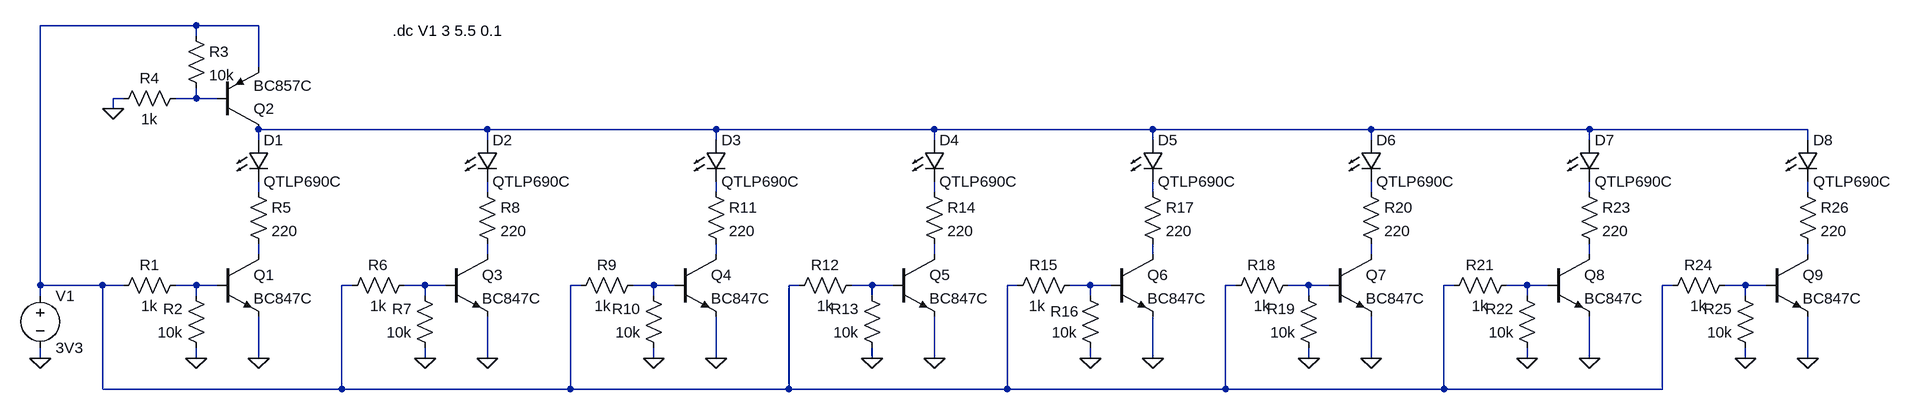
[diagram p0: schematic Comutarea7Segmentului.asc]
Comutarea7Segmentului.asc, the LTspice schematic file:
Version 4
SHEET 1 2660 680
WIRE 48 -272 -192 -272
WIRE 144 -272 48 -272
WIRE 48 -256 48 -272
WIRE 144 -208 144 -272
WIRE -64 -160 -80 -160
WIRE 48 -160 48 -176
WIRE 48 -160 16 -160
WIRE 80 -160 48 -160
WIRE -80 -144 -80 -160
WIRE 496 -112 144 -112
WIRE 848 -112 496 -112
WIRE 1184 -112 848 -112
WIRE 1520 -112 1184 -112
WIRE 1856 -112 1520 -112
WIRE 2192 -112 1856 -112
WIRE 2528 -112 2192 -112
WIRE 144 -96 144 -112
WIRE 496 -96 496 -112
WIRE 848 -96 848 -112
WIRE 1184 -96 1184 -112
WIRE 1520 -96 1520 -112
WIRE 1856 -96 1856 -112
WIRE 2192 -96 2192 -112
WIRE 2528 -96 2528 -112
WIRE 144 -16 144 -32
WIRE 496 -16 496 -32
WIRE 848 -16 848 -32
WIRE 1184 -16 1184 -32
WIRE 1520 -16 1520 -32
WIRE 1856 -16 1856 -32
WIRE 2192 -16 2192 -32
WIRE 2528 -16 2528 -32
WIRE 144 80 144 64
WIRE 496 80 496 64
WIRE 848 80 848 64
WIRE 1184 80 1184 64
WIRE 1520 80 1520 64
WIRE 1856 80 1856 64
WIRE 2192 80 2192 64
WIRE 2528 80 2528 64
WIRE -192 128 -192 -272
WIRE -96 128 -192 128
WIRE -64 128 -96 128
WIRE 48 128 16 128
WIRE 80 128 48 128
WIRE 288 128 272 128
WIRE 400 128 368 128
WIRE 432 128 400 128
WIRE 640 128 624 128
WIRE 752 128 720 128
WIRE 784 128 752 128
WIRE 976 128 960 128
WIRE 1088 128 1056 128
WIRE 1120 128 1088 128
WIRE 1312 128 1296 128
WIRE 1424 128 1392 128
WIRE 1456 128 1424 128
WIRE 1648 128 1632 128
WIRE 1760 128 1728 128
WIRE 1792 128 1760 128
WIRE 1984 128 1968 128
WIRE 2096 128 2064 128
WIRE 2128 128 2096 128
WIRE 2320 128 2304 128
WIRE 2432 128 2400 128
WIRE 2464 128 2432 128
WIRE -192 144 -192 128
WIRE 48 144 48 128
WIRE 400 144 400 128
WIRE 752 144 752 128
WIRE 1088 144 1088 128
WIRE 1424 144 1424 128
WIRE 1760 144 1760 128
WIRE 2096 144 2096 128
WIRE 2432 144 2432 128
WIRE -192 240 -192 224
WIRE 48 240 48 224
WIRE 144 240 144 176
WIRE 400 240 400 224
WIRE 496 240 496 176
WIRE 752 240 752 224
WIRE 848 240 848 176
WIRE 1088 240 1088 224
WIRE 1184 240 1184 176
WIRE 1424 240 1424 224
WIRE 1520 240 1520 176
WIRE 1760 240 1760 224
WIRE 1856 240 1856 176
WIRE 2096 240 2096 224
WIRE 2192 240 2192 176
WIRE 2432 240 2432 224
WIRE 2528 240 2528 176
WIRE -96 288 -96 128
WIRE 272 288 272 128
WIRE 272 288 -96 288
WIRE 624 288 624 128
WIRE 624 288 272 288
WIRE 960 288 960 128
WIRE 960 288 624 288
WIRE 1296 288 1296 128
WIRE 1296 288 960 288
WIRE 1632 288 1632 128
WIRE 1632 288 1296 288
WIRE 1968 288 1968 128
WIRE 1968 288 1632 288
WIRE 2304 288 2304 128
WIRE 2304 288 1968 288
FLAG 48 240 0
FLAG -192 240 0
FLAG 144 240 0
FLAG -80 -144 0
FLAG 400 240 0
FLAG 496 240 0
FLAG 752 240 0
FLAG 848 240 0
FLAG 1088 240 0
FLAG 1184 240 0
FLAG 1424 240 0
FLAG 1520 240 0
FLAG 1760 240 0
FLAG 1856 240 0
FLAG 2096 240 0
FLAG 2192 240 0
FLAG 2432 240 0
FLAG 2528 240 0
SYMBOL npn 80 80 R0
SYMATTR InstName Q1
SYMATTR Value BC847C
SYMBOL res 32 112 R90
WINDOW 0 0 56 VBottom 2
WINDOW 3 32 56 VTop 2
SYMATTR InstName R1
SYMATTR Value 1k
SYMBOL res 64 240 R180
WINDOW 0 36 76 Left 2
WINDOW 3 36 40 Left 2
SYMATTR InstName R2
SYMATTR Value 10k
SYMBOL voltage -192 128 R0
SYMATTR InstName V1
SYMATTR Value 3V3
SYMBOL pnp 80 -112 M180
SYMATTR InstName Q2
SYMATTR Value BC857C
SYMBOL res 32 -272 R0
SYMATTR InstName R3
SYMATTR Value 10k
SYMBOL res 32 -176 R90
WINDOW 0 0 56 VBottom 2
WINDOW 3 32 56 VTop 2
SYMATTR InstName R4
SYMATTR Value 1k
SYMBOL res 128 -32 R0
SYMATTR InstName R5
SYMATTR Value 220
SYMBOL LED 128 -96 R0
SYMATTR InstName D1
SYMATTR Value QTLP690C
SYMATTR Description Diode
SYMATTR Type diode
SYMBOL npn 432 80 R0
SYMATTR InstName Q3
SYMATTR Value BC847C
SYMBOL res 384 112 R90
WINDOW 0 0 56 VBottom 2
WINDOW 3 32 56 VTop 2
SYMATTR InstName R6
SYMATTR Value 1k
SYMBOL res 416 240 R180
WINDOW 0 36 76 Left 2
WINDOW 3 36 40 Left 2
SYMATTR InstName R7
SYMATTR Value 10k
SYMBOL res 480 -32 R0
SYMATTR InstName R8
SYMATTR Value 220
SYMBOL LED 480 -96 R0
SYMATTR InstName D2
SYMATTR Value QTLP690C
SYMATTR Description Diode
SYMATTR Type diode
SYMBOL npn 784 80 R0
SYMATTR InstName Q4
SYMATTR Value BC847C
SYMBOL res 736 112 R90
WINDOW 0 0 56 VBottom 2
WINDOW 3 32 62 VTop 2
SYMATTR InstName R9
SYMATTR Value 1k
SYMBOL res 768 240 R180
WINDOW 0 36 76 Left 2
WINDOW 3 36 40 Left 2
SYMATTR InstName R10
SYMATTR Value 10k
SYMBOL res 832 -32 R0
SYMATTR InstName R11
SYMATTR Value 220
SYMBOL LED 832 -96 R0
SYMATTR InstName D3
SYMATTR Value QTLP690C
SYMATTR Description Diode
SYMATTR Type diode
SYMBOL npn 1120 80 R0
SYMATTR InstName Q5
SYMATTR Value BC847C
SYMBOL res 1072 112 R90
WINDOW 0 0 56 VBottom 2
WINDOW 3 32 56 VTop 2
SYMATTR InstName R12
SYMATTR Value 1k
SYMBOL res 1104 240 R180
WINDOW 0 36 76 Left 2
WINDOW 3 36 40 Left 2
SYMATTR InstName R13
SYMATTR Value 10k
SYMBOL res 1168 -32 R0
SYMATTR InstName R14
SYMATTR Value 220
SYMBOL LED 1168 -96 R0
SYMATTR InstName D4
SYMATTR Value QTLP690C
SYMATTR Description Diode
SYMATTR Type diode
SYMBOL npn 1456 80 R0
SYMATTR InstName Q6
SYMATTR Value BC847C
SYMBOL res 1408 112 R90
WINDOW 0 0 56 VBottom 2
WINDOW 3 32 66 VTop 2
SYMATTR InstName R15
SYMATTR Value 1k
SYMBOL res 1440 240 R180
WINDOW 0 33 72 Left 2
WINDOW 3 36 40 Left 2
SYMATTR InstName R16
SYMATTR Value 10k
SYMBOL res 1504 -32 R0
SYMATTR InstName R17
SYMATTR Value 220
SYMBOL LED 1504 -96 R0
SYMATTR InstName D5
SYMATTR Value QTLP690C
SYMATTR Description Diode
SYMATTR Type diode
SYMBOL npn 1792 80 R0
SYMATTR InstName Q7
SYMATTR Value BC847C
SYMBOL res 1744 112 R90
WINDOW 0 0 56 VBottom 2
WINDOW 3 32 56 VTop 2
SYMATTR InstName R18
SYMATTR Value 1k
SYMBOL res 1776 240 R180
WINDOW 0 36 76 Left 2
WINDOW 3 36 40 Left 2
SYMATTR InstName R19
SYMATTR Value 10k
SYMBOL res 1840 -32 R0
SYMATTR InstName R20
SYMATTR Value 220
SYMBOL LED 1840 -96 R0
SYMATTR InstName D6
SYMATTR Value QTLP690C
SYMATTR Description Diode
SYMATTR Type diode
SYMBOL npn 2128 80 R0
SYMATTR InstName Q8
SYMATTR Value BC847C
SYMBOL res 2080 112 R90
WINDOW 0 0 56 VBottom 2
WINDOW 3 32 56 VTop 2
SYMATTR InstName R21
SYMATTR Value 1k
SYMBOL res 2112 240 R180
WINDOW 0 36 76 Left 2
WINDOW 3 36 40 Left 2
SYMATTR InstName R22
SYMATTR Value 10k
SYMBOL res 2176 -32 R0
SYMATTR InstName R23
SYMATTR Value 220
SYMBOL LED 2176 -96 R0
SYMATTR InstName D7
SYMATTR Value QTLP690C
SYMATTR Description Diode
SYMATTR Type diode
SYMBOL npn 2464 80 R0
SYMATTR InstName Q9
SYMATTR Value BC847C
SYMBOL res 2416 112 R90
WINDOW 0 0 56 VBottom 2
WINDOW 3 32 56 VTop 2
SYMATTR InstName R24
SYMATTR Value 1k
SYMBOL res 2448 240 R180
WINDOW 0 36 76 Left 2
WINDOW 3 36 40 Left 2
SYMATTR InstName R25
SYMATTR Value 10k
SYMBOL res 2512 -32 R0
SYMATTR InstName R26
SYMATTR Value 220
SYMBOL LED 2512 -96 R0
SYMATTR InstName D8
SYMATTR Value QTLP690C
SYMATTR Description Diode
SYMATTR Type diode
TEXT 350 -264 Left 2 !.dc V1 3 5.5 0.1

The netlist it stands for:
* Comutarea7Segmentului.asc
Q1 N012 N020 0 0 BC847C
R1 N020 N001 1k
R2 0 N020 10k
V1 N001 0 3V3
Q2 N003 N002 N001 0 BC857C
R3 N001 N002 10k
R4 N002 0 1k
R5 N004 N012 220
D1 N003 N004 QTLP690C
Q3 N013 N021 0 0 BC847C
R6 N021 N001 1k
R7 0 N021 10k
R8 N005 N013 220
D2 N003 N005 QTLP690C
Q4 N014 N022 0 0 BC847C
R9 N022 N001 1k
R10 0 N022 10k
R11 N006 N014 220
D3 N003 N006 QTLP690C
Q5 N015 N023 0 0 BC847C
R12 N023 N001 1k
R13 0 N023 10k
R14 N007 N015 220
D4 N003 N007 QTLP690C
Q6 N016 N024 0 0 BC847C
R15 N024 N001 1k
R16 0 N024 10k
R17 N008 N016 220
D5 N003 N008 QTLP690C
Q7 N017 N025 0 0 BC847C
R18 N025 N001 1k
R19 0 N025 10k
R20 N009 N017 220
D6 N003 N009 QTLP690C
Q8 N018 N026 0 0 BC847C
R21 N026 N001 1k
R22 0 N026 10k
R23 N010 N018 220
D7 N003 N010 QTLP690C
Q9 N019 N027 0 0 BC847C
R24 N027 N001 1k
R25 0 N027 10k
R26 N011 N019 220
D8 N003 N011 QTLP690C
.model D D
.lib standard.dio
.model NPN NPN
.model PNP PNP
.lib standard.bjt
.dc V1 3 5.5 0.1
.backanno
.end